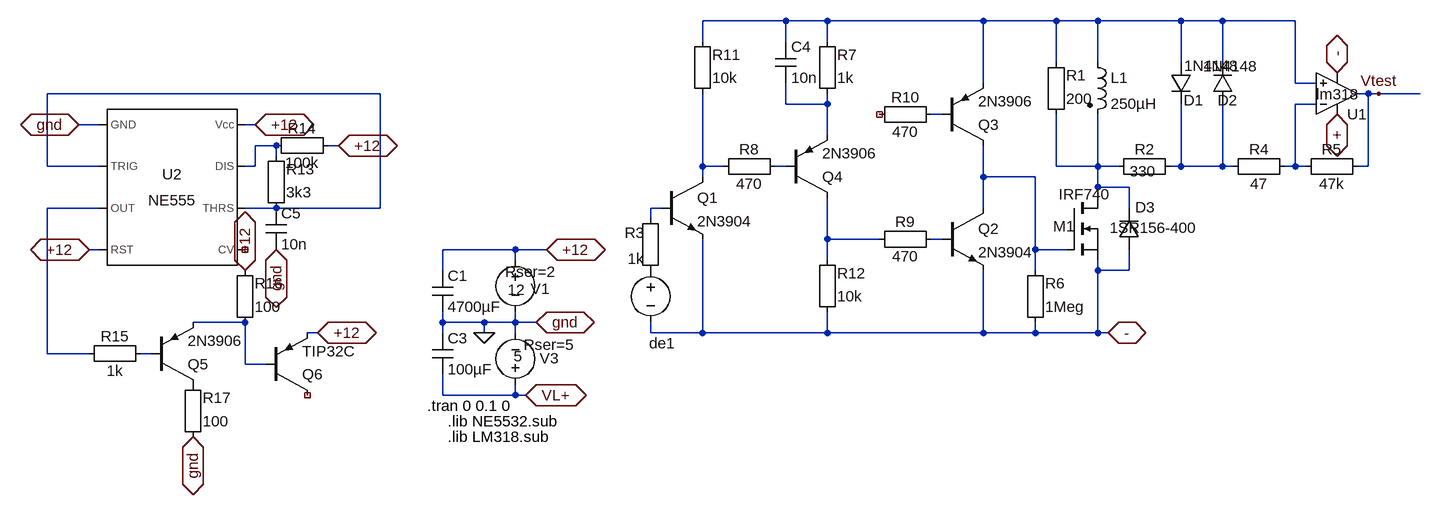
[diagram p0: schematic surfmaster_pi_10.asc]
surfmaster_pi_10.asc, the LTspice schematic file:
Version 4
SHEET 1 1412 680
WIRE 432 -416 304 -416
WIRE 496 -416 432 -416
WIRE 736 -416 496 -416
WIRE 848 -416 736 -416
WIRE 912 -416 848 -416
WIRE 1040 -416 912 -416
WIRE 1104 -416 1040 -416
WIRE 1216 -416 1104 -416
WIRE 304 -384 304 -416
WIRE 432 -384 432 -416
WIRE 496 -384 496 -416
WIRE 848 -352 848 -416
WIRE 912 -352 912 -416
WIRE 1040 -352 1040 -416
WIRE 1104 -352 1104 -416
WIRE 736 -320 736 -416
WIRE 1216 -320 1216 -416
WIRE 1248 -320 1216 -320
WIRE -192 -304 -704 -304
WIRE 1328 -304 1312 -304
WIRE 1344 -304 1328 -304
WIRE 1408 -304 1344 -304
WIRE 432 -288 432 -320
WIRE 496 -288 496 -304
WIRE 496 -288 432 -288
WIRE 1248 -288 1216 -288
WIRE 672 -272 656 -272
WIRE -624 -256 -656 -256
WIRE -384 -256 -400 -256
WIRE 496 -240 496 -288
WIRE -352 -224 -384 -224
WIRE -256 -224 -272 -224
WIRE -352 -208 -352 -224
WIRE -704 -192 -704 -304
WIRE -624 -192 -704 -192
WIRE -384 -192 -384 -224
WIRE -384 -192 -400 -192
WIRE 304 -192 304 -304
WIRE 336 -192 304 -192
WIRE 432 -192 416 -192
WIRE 848 -192 848 -272
WIRE 912 -192 912 -272
WIRE 912 -192 848 -192
WIRE 944 -192 912 -192
WIRE 1040 -192 1040 -288
WIRE 1040 -192 1024 -192
WIRE 1104 -192 1104 -288
WIRE 1104 -192 1040 -192
WIRE 1120 -192 1104 -192
WIRE 1216 -192 1216 -288
WIRE 1216 -192 1200 -192
WIRE 1232 -192 1216 -192
WIRE 1328 -192 1328 -304
WIRE 1328 -192 1312 -192
WIRE 304 -176 304 -192
WIRE 736 -176 736 -224
WIRE 816 -176 736 -176
WIRE 912 -160 912 -192
WIRE 960 -160 912 -160
WIRE 912 -144 912 -160
WIRE -624 -128 -704 -128
WIRE -352 -128 -400 -128
WIRE -192 -128 -192 -304
WIRE -192 -128 -352 -128
WIRE 240 -128 224 -128
WIRE 736 -128 736 -176
WIRE 960 -128 960 -160
WIRE 224 -112 224 -128
WIRE 496 -80 496 -144
WIRE 576 -80 496 -80
WIRE 672 -80 656 -80
WIRE -624 -64 -640 -64
WIRE 16 -64 -96 -64
WIRE 64 -64 16 -64
WIRE 816 -64 816 -176
WIRE 864 -64 816 -64
WIRE 16 -48 16 -64
WIRE 496 -48 496 -80
WIRE -96 -32 -96 -64
WIRE 816 -32 816 -64
WIRE 912 -32 912 -48
WIRE 960 -32 960 -64
WIRE 960 -32 912 -32
WIRE -400 48 -480 48
WIRE -96 48 -96 32
WIRE -32 48 -96 48
WIRE 16 48 16 32
WIRE 16 48 -32 48
WIRE 48 48 16 48
WIRE -288 64 -304 64
WIRE -96 64 -96 48
WIRE -32 64 -32 48
WIRE 16 64 16 48
WIRE 224 64 224 48
WIRE 304 64 304 -80
WIRE 304 64 224 64
WIRE 496 64 496 32
WIRE 496 64 304 64
WIRE 736 64 736 -32
WIRE 736 64 496 64
WIRE 816 64 816 48
WIRE 816 64 736 64
WIRE 912 64 912 -32
WIRE 912 64 816 64
WIRE 928 64 912 64
WIRE -704 96 -704 -128
WIRE -640 96 -704 96
WIRE -544 96 -560 96
WIRE -400 112 -400 48
WIRE -368 112 -400 112
WIRE -96 160 -96 128
WIRE 16 160 16 144
WIRE 16 160 -96 160
WIRE 32 160 16 160
FLAG 48 48 gnd
IOPIN 48 48 BiDir
FLAG -32 64 0
FLAG 32 160 VL+
IOPIN 32 160 BiDir
FLAG 1280 -272 +
IOPIN 1280 -272 BiDir
FLAG 1280 -336 -
IOPIN 1280 -336 BiDir
FLAG 928 64 -
IOPIN 928 64 BiDir
FLAG 1344 -304 Vtest
FLAG 64 -64 +12
IOPIN 64 -64 BiDir
FLAG -256 -224 +12
IOPIN -256 -224 BiDir
FLAG -384 -256 +12
IOPIN -384 -256 BiDir
FLAG -400 -32 +12
IOPIN -400 -32 BiDir
FLAG -640 -64 +12
IOPIN -640 -64 BiDir
FLAG -288 64 +12
IOPIN -288 64 BiDir
FLAG -656 -256 gnd
IOPIN -656 -256 BiDir
FLAG -480 224 gnd
IOPIN -480 224 BiDir
FLAG -352 -64 gnd
IOPIN -352 -64 BiDir
SYMBOL voltage 16 -64 M0
WINDOW 123 0 0 Left 2
WINDOW 39 -63 34 Left 2
WINDOW 0 -53 60 Left 2
WINDOW 3 -15 62 Left 2
SYMATTR SpiceLine Rser=2
SYMATTR InstName V1
SYMATTR Value 12
SYMBOL voltage 16 160 M180
WINDOW 123 0 0 Left 2
WINDOW 39 13 78 Left 2
WINDOW 0 37 57 Left 2
WINDOW 3 -3 60 Left 2
SYMATTR SpiceLine Rser=5
SYMATTR InstName V3
SYMATTR Value 5
SYMBOL Misc\\EuropeanCap -112 -32 R0
SYMATTR InstName C1
SYMATTR Value 4700µF
SYMATTR SpiceLine V=400 Irms=1 Rser=.32 Lser=0
SYMBOL Misc\\EuropeanCap -112 64 R0
SYMATTR InstName C3
SYMATTR Value 100µF
SYMATTR SpiceLine V=400 Irms=1 Rser=.32 Lser=0
SYMBOL Misc\\EuropeanResistor 832 -256 M180
WINDOW 0 31 76 Left 2
WINDOW 3 31 40 Left 2
SYMATTR InstName R1
SYMATTR Value 200
SYMBOL Misc\\EuropeanResistor 928 -208 M90
WINDOW 0 5 56 VBottom 2
WINDOW 3 8 53 VTop 2
SYMATTR InstName R2
SYMATTR Value 330
SYMBOL diode 1024 -352 R0
WINDOW 3 21 5 Left 2
WINDOW 0 20 58 Left 2
SYMATTR Value 1N4148
SYMATTR InstName D1
SYMBOL diode 1120 -288 R180
WINDOW 0 -7 6 Left 2
WINDOW 3 -39 58 Left 2
SYMATTR InstName D2
SYMATTR Value 1N4148
SYMBOL nmos 864 -144 R0
WINDOW 0 -21 44 Left 2
WINDOW 3 -12 -5 Left 2
SYMATTR InstName M1
SYMATTR Value IRF740
SYMBOL voltage 224 -48 M0
WINDOW 0 -38 128 Left 2
WINDOW 3 -134 119 Invisible 2
WINDOW 123 0 0 Left 2
SYMATTR InstName de1
SYMATTR Value PULSE(0 4.8 .010115 0 0 .000002 .01 1000)
SYMATTR SpiceLine Rser=0
SYMBOL npn3 240 -176 R0
SYMATTR InstName Q1
SYMATTR Value 2N3904
SYMBOL Misc\\EuropeanResistor 208 -16 M180
WINDOW 0 -24 74 Left 2
WINDOW 3 -19 34 Left 2
SYMATTR InstName R3
SYMATTR Value 1k
SYMBOL Opamps\\opamp2 1280 -240 M180
WINDOW 3 -32 63 Left 2
SYMATTR Value lm318
SYMATTR InstName U1
SYMBOL Misc\\EuropeanResistor 1104 -176 R270
WINDOW 0 27 56 VTop 2
WINDOW 3 5 56 VBottom 2
SYMATTR InstName R4
SYMATTR Value 47
SYMBOL Misc\\EuropeanResistor 1216 -176 R270
WINDOW 0 27 56 VTop 2
WINDOW 3 5 56 VBottom 2
SYMATTR InstName R5
SYMATTR Value 47k
SYMBOL npn3 672 -128 R0
SYMATTR InstName Q2
SYMATTR Value 2N3904
SYMBOL diode 976 -64 R180
WINDOW 0 -24 65 Left 2
WINDOW 3 -90 34 Left 2
SYMATTR InstName D3
SYMATTR Value 1SR156-400
SYMATTR Description Zener Diode
SYMATTR Type zener
SYMBOL pnp2 672 -224 M180
SYMATTR InstName Q3
SYMATTR Value 2N3906
SYMBOL Misc\\EuropeanResistor 800 64 M180
WINDOW 0 31 76 Left 2
WINDOW 3 31 40 Left 2
SYMATTR InstName R6
SYMATTR Value 1Meg
SYMBOL pnp2 432 -144 M180
SYMATTR InstName Q4
SYMATTR Value 2N3906
SYMBOL Misc\\EuropeanResistor 480 -288 M180
WINDOW 0 31 76 Left 2
WINDOW 3 31 40 Left 2
SYMATTR InstName R7
SYMATTR Value 1k
SYMBOL Misc\\EuropeanResistor 320 -208 M90
WINDOW 0 5 56 VBottom 2
WINDOW 3 27 56 VTop 2
SYMATTR InstName R8
SYMATTR Value 470
SYMBOL Misc\\EuropeanCap 416 -384 R0
SYMATTR InstName C4
SYMATTR Value 10n
SYMATTR SpiceLine V=400 Irms=1 Rser=.32 Lser=0
SYMBOL Misc\\EuropeanResistor 672 -64 M270
WINDOW 0 27 56 VTop 2
WINDOW 3 5 56 VBottom 2
SYMATTR InstName R9
SYMATTR Value 470
SYMBOL Misc\\EuropeanResistor 560 -288 M90
WINDOW 0 5 56 VBottom 2
WINDOW 3 27 56 VTop 2
SYMATTR InstName R10
SYMATTR Value 470
SYMBOL Misc\\EuropeanResistor 288 -288 M180
WINDOW 0 31 76 Left 2
WINDOW 3 31 40 Left 2
SYMATTR InstName R11
SYMATTR Value 10k
SYMBOL Misc\\EuropeanResistor 480 48 M180
WINDOW 0 31 76 Left 2
WINDOW 3 31 40 Left 2
SYMATTR InstName R12
SYMATTR Value 10k
SYMBOL ind2 896 -368 R0
SYMATTR InstName L1
SYMATTR Value 250µH
SYMATTR SpiceLine Rser=.4 Cpar=20p
SYMATTR Type ind
SYMBOL Misc\\NE555 -512 -160 R0
SYMATTR InstName U2
SYMBOL Misc\\EuropeanResistor -368 -112 M180
WINDOW 0 31 76 Left 2
WINDOW 3 31 40 Left 2
SYMATTR InstName R13
SYMATTR Value 3k3
SYMBOL Misc\\EuropeanResistor -368 -240 M90
WINDOW 0 5 56 VBottom 2
WINDOW 3 27 56 VTop 2
SYMATTR InstName R14
SYMATTR Value 100k
SYMBOL Misc\\EuropeanCap -368 -128 R0
SYMATTR InstName C5
SYMATTR Value 10n
SYMATTR SpiceLine V=400 Irms=1 Rser=.32 Lser=0
SYMBOL pnp2 -544 144 M180
SYMATTR InstName Q5
SYMATTR Value 2N3906
SYMBOL Misc\\EuropeanResistor -656 80 M90
WINDOW 0 5 56 VBottom 2
WINDOW 3 27 56 VTop 2
SYMATTR InstName R15
SYMATTR Value 1k
SYMBOL pnp2 -368 160 M180
SYMATTR InstName Q6
SYMATTR Value TIP32C
SYMBOL Misc\\EuropeanResistor -416 64 M180
WINDOW 0 31 76 Left 2
WINDOW 3 31 40 Left 2
SYMATTR InstName R16
SYMATTR Value 100
SYMBOL Misc\\EuropeanResistor -496 240 M180
WINDOW 0 31 76 Left 2
WINDOW 3 31 40 Left 2
SYMATTR InstName R17
SYMATTR Value 100
TEXT -120 176 Left 2 !.tran 0 0.1 0
TEXT -88 200 Left 2 !.lib NE5532.sub
TEXT -88 224 Left 2 !.lib LM318.sub

The netlist it stands for:
* surfmaster_pi_10.asc
V1 +12 0 12 Rser=2
V3 VL+ 0 5 Rser=5
C1 +12 0 4700µF V=400 Irms=1 Rser=.32 Lser=0
C3 0 VL+ 100µF V=400 Irms=1 Rser=.32 Lser=0
R1 N009 N001 200
R2 N009 N010 330
D1 N001 N010 1N4148
D2 N010 N001 1N4148
M1 N009 N011 - - IRF740
V§de1 P001 - PULSE(0 4.8 .010115 0 0 .000002 .01 1000) Rser=0
Q1 N007 N013 - 0 2N3904
R3 P001 N013 1k
XU1 N001 N004 + - Vtest lm318  ; pins In+ In- V+ V- OUT
R4 N010 N004 47
R5 N004 Vtest 47k
Q2 N011 N015 - 0 2N3904
D3 - N009 1SR156-400
Q3 N011 N005 N001 0 2N3906
R6 - N011 1Meg
Q4 N014 N008 N003 0 2N3906
R7 N003 N001 1k
R8 N007 N008 470
C4 N001 N003 10n V=400 Irms=1 Rser=.32 Lser=0
R9 N015 N014 470
R10 NC_01 N005 470
R11 N007 N001 10k
R12 - N014 10k
L1 N001 N009 250µH Rser=.4 Cpar=20p
XU2 0 N002 N012 +12 NC_02 N002 N006 +12 NE555  ; pins GND TRIG OUT RST CV THRS DIS Vcc
R13 N002 N006 3k3
R14 N006 +12 100k
C5 N002 0 10n V=400 Irms=1 Rser=.32 Lser=0
Q5 P002 N017 N016 0 2N3906
R15 N012 N017 1k
Q6 NC_03 N016 +12 0 TIP32C
R16 N016 +12 100
R17 0 P002 100
.model D D
.lib standard.dio
.model NPN NPN
.model PNP PNP
.lib standard.bjt
.model NMOS NMOS
.model PMOS PMOS
.lib standard.mos
.tran 0 0.1 0
.lib NE5532.sub
.lib LM318.sub
.lib NE555.sub
.backanno
.end